# EAGLE design motorthing-v2smd (EAGLE 7.5.0)
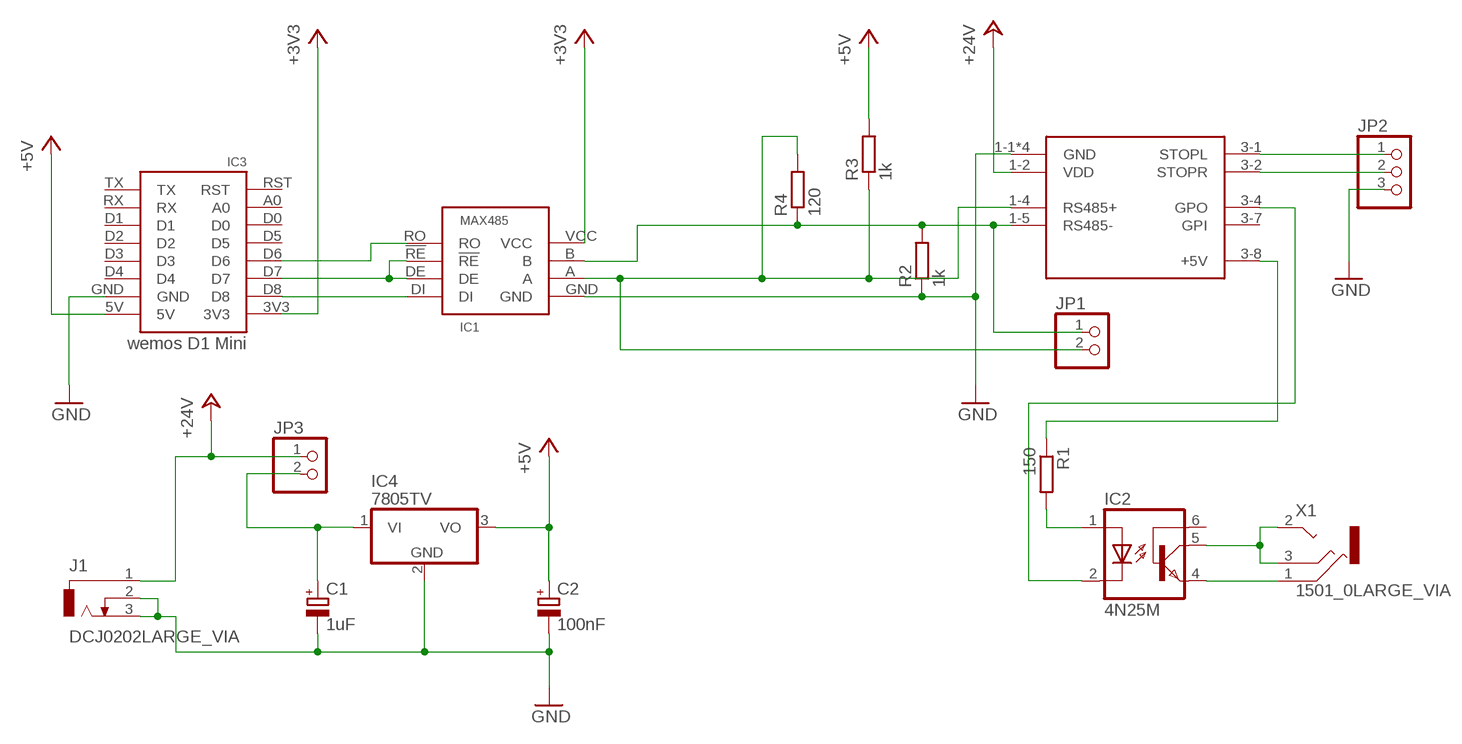
[diagram p0: schematic, sheet 1]

## Parts
C1  1uF  CPOL-EUTT2D6  [TT2D6]
C2  100nF  CPOL-EUTT2D5  [TT2D5]
IC1  MAX485  [DIL08]
IC2  4N25M  [DIL06]
IC3  wemos D1 Mini  WEMOSNOSILK  [WEMOS-NOSILK]
IC4  7805TV  [TO220V]
J1  DCJ0202LARGE_VIA  [DCJ0202_LV]
JP1  PINHD-1X2  [1X02]
JP2  PINHD-1X3  [1X03]
JP3  PINHD-1X2  [1X02]
R1  150  R-EU_0207/10  [0207/10]
R2  1k  R-EU_0207/10  [0207/10]
R3  1k  R-EU_0207/10  [0207/10]
R4  120  R-EU_0207/10  [0207/10]
TMCM-110  TMCM-110SMD  [TMCM-110_SMD]
X1  1501_0LARGE_VIA  [1501_05_LV]

## Nets
+3V3: IC1.VCC IC3.3V3
+5V [high_voltage]: C2.+ IC3.5V IC4.3(VO) R3.2
+24V [high_voltage]: J1.1 JP3.1 TMCM-110.1-2(VDD)
GND: C1.- C2.- IC1.GND IC3.GND IC4.2(GND) J1.2 J1.3 JP2.3 R2.1 TMCM-110.1-1(GND) TMCM-110.1-3(GND) TMCM-110.3-3(GND) TMCM-110.3-6(GND)
N$1: IC2.1(A) R1.2
N$2: IC2.4(EMI) X1.1
N$3: IC1.RO IC3.D6
N$4: IC1.DI IC3.D8
N$5: IC1.B JP1.1 R2.2 R4.1 TMCM-110.1-5(RS485-)
N$6: IC2.5(COL) X1.2 X1.3
N$7: R1.1 TMCM-110.3-8(+5V)
N$8: IC2.2(C) TMCM-110.3-4(GPO)
N$9: JP2.1 TMCM-110.3-1(STOPL)
N$10: IC1.!RE IC1.DE IC3.D7
N$11: IC1.A JP1.2 R3.1 R4.2 TMCM-110.1-4(RS485+)
N$12: JP2.2 TMCM-110.3-2(STOPR)
N$13 [high_voltage]: C1.+ IC4.1(VI) JP3.2
Unconnected: IC2.6(BAS) IC3.A0 IC3.D0 IC3.D1 IC3.D2 IC3.D3 IC3.D4 IC3.D5 IC3.RST IC3.RX IC3.TX TMCM-110.3-7(GPI)

## Library data of the parts
C1 C2 = rcl:CPOL-EU: POLARIZED CAPACITOR, European symbol
IC1 = max348x:MAX485
IC2 = optocoupler:4N*?M: General Purpose 6-Pin Phototransistor Optocouplers Source: http://www.fairchildsemi.com/ds/4N/4N35-M.pdf; MPN: 4N25-M; OC_FARNELL: 1021349; OC_NEWARK: 98K9084
IC3 = wemos:WEMOS
IC4 = linear:78*: Positive VOLTAGE REGULATOR Source: http://cache.national.com/ds/LM/LM78L05.pdf http://www.fairchildsemi.com/ds/LM/LM7805.pdf
J1 = myparts:DCJ0202: DC POWER JACK Source: DCJ0202.pdf
JP1 JP3 = pinhead:PINHD-1X2: PIN HEADER
JP2 = pinhead:PINHD-1X3: PIN HEADER
R1-R4 = rcl:R-EU_: RESISTOR, European symbol
TMCM-110 = TMCM:TMCM-110
X1 = myparts:1501_0*: Jack connectors according to JISC 6560, 2.5 mm Klinkensteckverbinder nach JISC 6560, 2,5 mm Source: http://www.lumberg.com/Produkte/PDFs/1501_05.pdfedit 1501_03 http://www.lumberg.com/Produkte/PDFs/1501_06.pdf

## Net classes
0 default: clearance 0.205 mm
1 high_voltage: width 1.016 mm, clearance 0.205 mm to class 0, clearance 0.254 mm

## Board
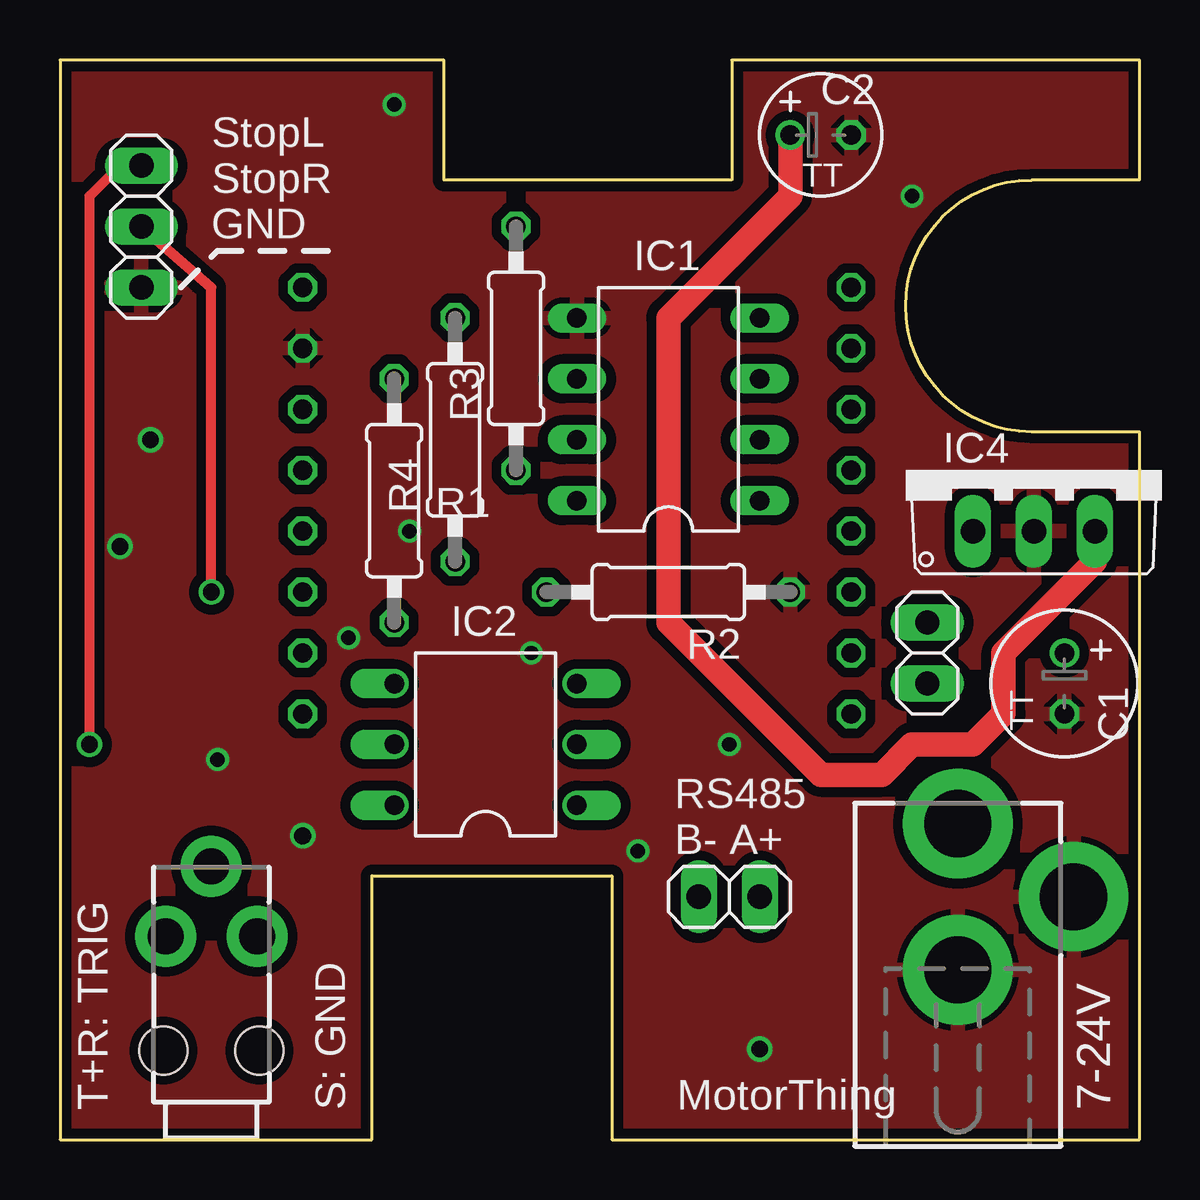
[diagram p1: board, top side]
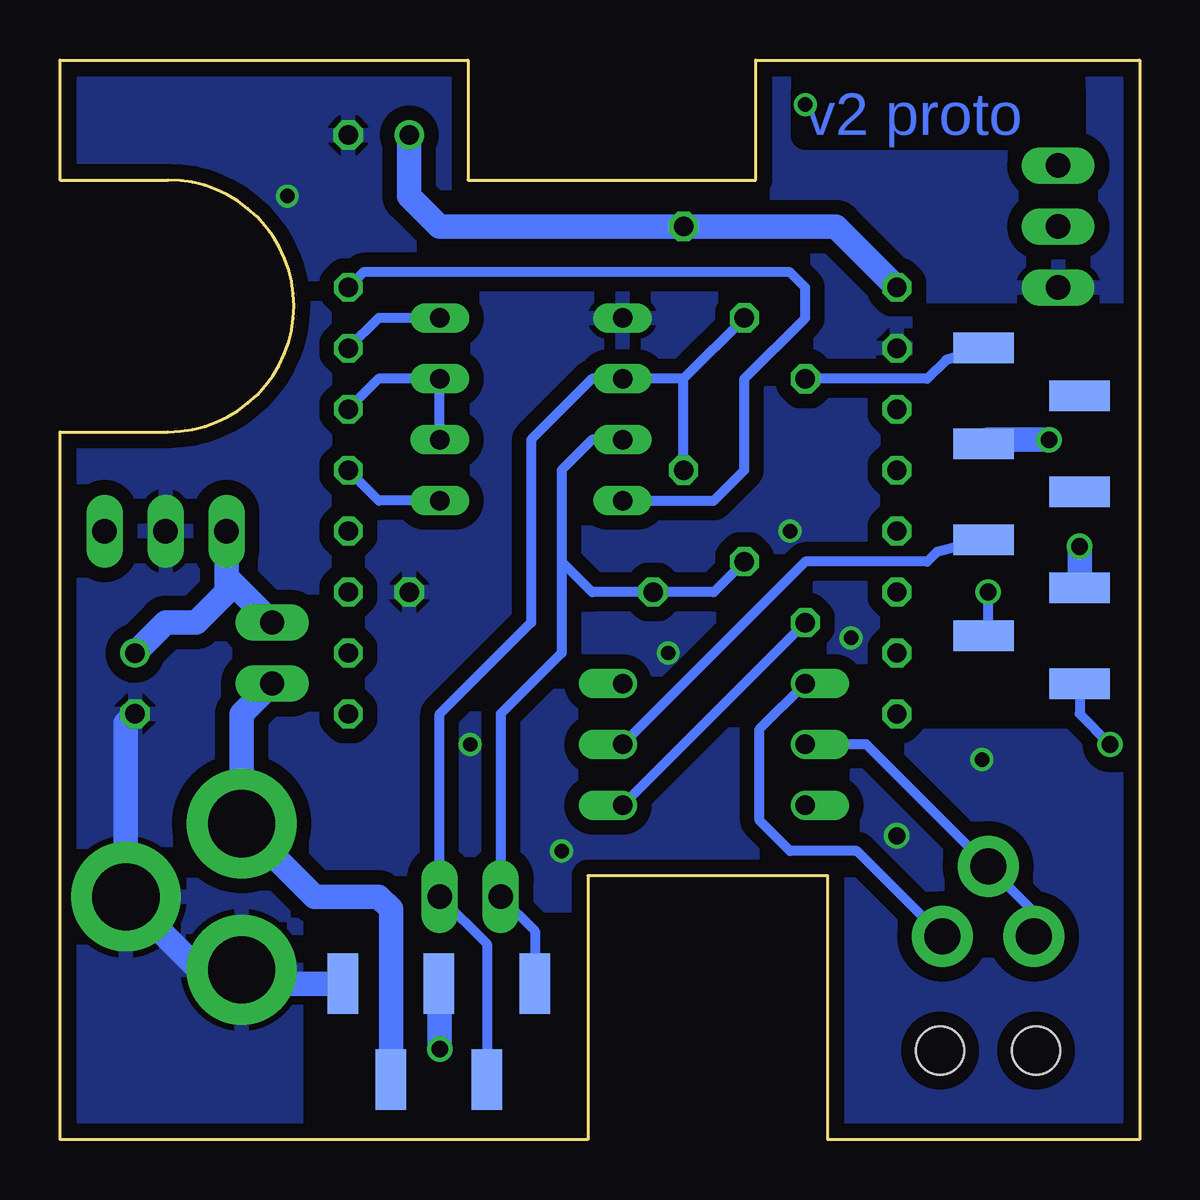
[diagram p2: board, bottom side, seen from below]

Size 45 x 45 mm. Coordinates in mm from the lower left corner, seen from the top.
Copper layers (1*16): Top 0.0356mm / dielectric 1.5011mm / Bottom 0.0356mm
Design rules "LaenPCBOrder": minimum track width 6mil, minimum drill 13mil, track to track 6mil, track to pad 6mil, pad to pad 6mil, via to via 6mil, smd to smd 6mil, copper to edge 15mil, drill to drill 6mil, minimum pad ring 7mil, minimum via ring 7mil, stop-mask expansion 3mil, vias tented up to drill 0mil, thermal gap 10mil
bRestrict: area 0,17.7 to 8.9,34.2; area 24.1,0 to 34.2,8.8

### Footprints (pad centres in the part's own frame; a part is rotated, then mirrored left to right if it is on the bottom)
TT2D6 = drill 0.813: + -1.27,0 | drill 0.813 octagon: - 1.27,0
TT2D5 = drill 0.813: + -1.27,0 | drill 0.813 octagon: - 1.27,0
DIL08 = drill 0.813 long: !RE -1.27,-3.81; A 1.27,3.81; B -1.27,3.81; DE 1.27,-3.81; DI 3.81,-3.81; GND 3.81,3.81; RO -3.81,-3.81; VCC -3.81,3.81
DIL06 = drill 0.813 offset: 1 -2.54,-3.81; 2 0,-3.81; 3 2.54,-3.81; 4 2.54,3.81; 5 0,3.81; 6 -2.54,3.81
WEMOS-NOSILK = drill 0.8 octagon: 3V3 0,0; 5V 22.86,0; A0 0,15.24; D0 0,12.7; D1 22.86,12.7; D2 22.86,10.16; D3 22.86,7.62; D4 22.86,5.08; D5 0,10.16; D6 0,7.62; D7 0,5.08; D8 0,2.54; GND 22.86,2.54; RST 0,17.78; RX 22.86,15.24; TX 22.86,17.78
TO220V = drill 1.016 long: 1 -2.54,-2.54; 2 0,-2.54; 3 2.54,-2.54
DCJ0202_LV = drill 2.8 pad 4.572: 1 0,3.048; 2 4.826,0; 3 0,-3.048
1X02 = drill 1.016 long: 1 -1.27,0; 2 1.27,0
1X03 = drill 1.016 long: 1 -2.54,0; 2 0,0; 3 2.54,0
0207/10 = drill 0.813 octagon: 1 -5.08,0; 2 5.08,0
TMCM-110_SMD = smd 1.27 x 2.54 bottom: 1-1 30.2,3.5; 1-2 28.2,-0.5; 1-3 26.2,3.5; 1-4 24.2,-0.5; 1-5 22.2,3.5 | smd 2.54 x 1.27 bottom: 3-1 -0.5,16; 3-2 3.5,18; 3-3 -0.5,20; 3-4 3.5,22; 3-5 -0.5,24; 3-6 3.5,26; 3-7 -0.5,28; 3-8 3.5,30
1501_05_LV = drill 1.5 pad 2.54: 1 -1.905,-8.509; 2 0,-11.43; 3 1.905,-8.509 | hole 2: -2,-3.75; 2,-3.75

### Placement (x,y rotation side)
C1  41.87,19.01 270 top
C2  31.71,41.87 0 top
IC1  25.36,30.44 90 top
IC2  17.74,16.47 90 top
IC3  32.98,35.52 180 top
IC4  40.6,27.9 0 top
J1  37.42,10.12 0 top
JP1  27.9,10.12 0 top
JP2  3.39,38.06 270 top
JP3  36.16,20.28 90 top
R1  13.93,26.63 270 top
R2  25.36,22.82 180 top
R3  19.01,32.98 90 top
R4  16.47,29.17 90 top
TMCM-110  3,3 0 top
X1  6.31,-0.04 180 top

### Tracks (layer width: path | path; a pad name or v marks a point on that pad's centre or on a via)
+3V3
  Bottom 0.406: IC1.VCC 17.74,26.63 16.47,27.9 16.47,31.71 13.93,34.25 13.93,35.52 14.57,36.16 32.34,36.16 IC3.3V3
+5V
  Top 1.016: C2.+ 30.44,39.33 25.36,34.25 25.36,21.55 31.71,15.2 34.25,15.2 35.52,16.47 38.06,16.47 39.33,17.74 39.33,20.28 43.14,24.09 IC4.3
  Bottom 1.016: IC3.5V 12.66,38.06 R3.2 29.17,38.06 30.44,39.33 C2.+
+24V
  Bottom 1.016: JP3.1 37.42,17.74 J1.1 34.38,10.12 31.71,10.12 31.2,9.61 TMCM-110.1-2
GND  (via drill 0.6, 0.7)
  Bottom 1.016: C1.- 42.25,17.36 J1.2 39.2,7.07 J1.3 36.85,6.5 TMCM-110.1-1 | v29.17,3.77 29.17,6.47 TMCM-110.1-3 | TMCM-110.3-3 v2.5,24.73 | v3.77,29.17 6.33,29.17 TMCM-110.3-6
  other vias: 6.56,15.83 12.03,20.91 24.09,12.03 19.64,20.28 35.52,39.33 13.93,43.14 14.57,25.36 27.9,16.47 10.12,12.66
  pour Bottom (isolate 0.61): -0.04,-0.04 45.04,-0.04 45.04,45.05 -0.04,45.05
  pour Top (isolate 0.406): -0.04,-0.04 45.04,-0.04 45.04,45.05 -0.04,45.05
N$1
  Bottom 0.406: R1.2 IC2.1
N$2
  Bottom 0.406: X1.1 11.77,12.03 14.57,12.03 15.84,13.29 15.84,17.1 IC2.4
N$3
  Bottom 0.406: IC1.RO 31.71,26.63 IC3.D6
N$4
  Bottom 0.406: IC1.DI 31.71,34.25 IC3.D8
N$5
  Bottom 0.406: IC1.B 22.82,29.17 24.09,27.9 24.09,24.09 | 24.09,24.09 24.09,20.28 26.63,17.74 JP1.1 25.2,8.69 TMCM-110.1-5 | 24.09,24.09 22.82,22.82 R2.2 17.74,22.82 R4.1
N$6
  Bottom 0.406: IC2.5 11.39,16.47 X1.2 4.41,9.49 X1.3
N$7
  Bottom 0.406: TMCM-110.3-8 8.06,32.5 8.85,31.71 R1.1
N$8
  Bottom 0.406: TMCM-110.3-4 8.44,24.5 8.85,24.09 13.93,24.09 IC2.2
N$9  (via drill 0.7)
  Top 0.406: v1.23,16.47 1.23,39.33 2.5,40.6 JP2.1
  Bottom 0.406: TMCM-110.3-1 2.5,17.74 v1.23,16.47
N$10
  Bottom 0.406: IC3.D7 31.71,31.71 IC1.DE IC1.!RE
N$11
  Bottom 0.406: R4.2 19.01,31.71 | 19.01,31.71 IC1.A 22.82,31.71 25.36,29.17 25.36,21.55 29.17,17.74 JP1.2 27.2,8.15 TMCM-110.1-4 | R3.1 19.01,31.71
N$12  (via drill 0.7)
  Top 0.406: v6.31,22.82 6.31,35.52 JP2.2
  Bottom 0.406: TMCM-110.3-2 6.31,21 v6.31,22.82
N$13
  Bottom 1.016: C1.+ 40.6,21.55 39.33,21.55 38.06,22.82 IC4.1 38.06,23.45 JP3.2

### Text on the board
Bottom: v2 proto
tPlace: StopL / StopR / GND | RS485 / B- A+ | MotorThing | T+R: TRIG | S: GND | 7-24V